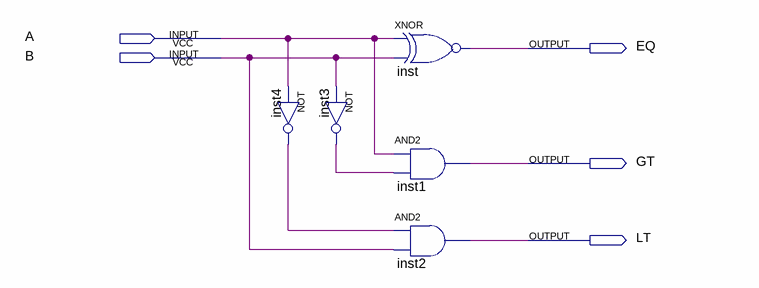
[diagram p0: schematic sheet]
// Quartus schematic 1bit_comparator.bdf as structural Verilog: 5 symbols, 5 pins
module \1bit_comparator  (
  input  A,
  input  B,
  output EQ,
  output GT,
  output LT
);

  wire inst3_out, inst4_out;

  not inst4 (inst4_out, A);
  not inst3 (inst3_out, B);
  xnor inst (EQ, A, B);
  and inst1 (GT, A, inst3_out);
  and inst2 (LT, inst4_out, B);
endmodule
